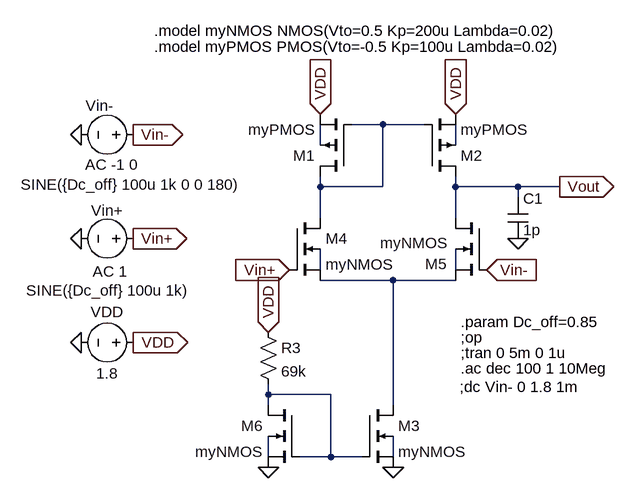
[diagram p0: schematic Cmos_Differential_Amplifier.asc]
Cmos_Differential_Amplifier.asc, the LTspice schematic file:
Version 4
SHEET 1 880 680
WIRE 160 -80 112 -80
WIRE 224 -80 160 -80
WIRE 64 -48 64 -80
WIRE 272 -48 272 -80
WIRE 64 16 64 0
WIRE 160 16 160 -80
WIRE 160 16 64 16
WIRE 272 16 272 0
WIRE 368 16 272 16
WIRE 432 16 368 16
WIRE 368 32 368 16
WIRE 64 64 64 16
WIRE 272 64 272 16
WIRE 64 144 64 112
WIRE 272 144 272 112
WIRE 176 160 64 160
WIRE 272 160 176 160
WIRE -16 336 -16 320
WIRE 80 336 -16 336
WIRE -16 352 -16 336
WIRE 176 352 176 160
WIRE -16 432 -16 400
WIRE 80 432 80 336
WIRE 80 432 32 432
WIRE 128 432 80 432
WIRE 176 432 176 400
FLAG -304 256 0
FLAG -224 256 VDD
IOPIN -224 256 Out
FLAG 64 -96 VDD
IOPIN 64 -96 In
FLAG 272 -96 VDD
IOPIN 272 -96 In
FLAG 432 16 Vout
IOPIN 432 16 Out
FLAG -304 96 0
FLAG -304 -64 0
FLAG -16 448 0
FLAG 176 448 0
FLAG -16 240 VDD
IOPIN -16 240 In
FLAG -224 96 Vin+
IOPIN -224 96 Out
FLAG -224 -64 Vin-
IOPIN -224 -64 Out
FLAG 320 144 Vin-
IOPIN 320 144 In
FLAG 16 144 Vin+
IOPIN 16 144 In
FLAG 368 96 0
SYMBOL voltage -208 96 R90
WINDOW 0 -59 56 VTop 2
WINDOW 3 64 55 VTop 2
WINDOW 123 35 52 VTop 2
WINDOW 39 0 0 Left 0
SYMATTR InstName Vin+
SYMATTR Value SINE({Dc_off} 100u 1k)
SYMATTR Value2 AC 1
SYMBOL voltage -208 256 R90
WINDOW 0 -32 56 VBottom 2
WINDOW 3 32 56 VTop 2
SYMATTR InstName VDD
SYMATTR Value 1.8
SYMBOL voltage -208 -64 M270
WINDOW 0 45 46 VRight 2
WINDOW 3 -77 -150 VRight 2
WINDOW 123 -46 8 VRight 2
WINDOW 39 0 0 Left 0
SYMATTR InstName Vin-
SYMATTR Value SINE({Dc_off} 100u 1k 0 0 180)
SYMATTR Value2 AC -1 0
SYMBOL pmos4 112 0 R180
SYMATTR InstName M1
SYMATTR Value myPMOS
SYMATTR Value2 l=1u w=4u
SYMBOL pmos4 224 0 M180
SYMATTR InstName M2
SYMATTR Value myPMOS
SYMATTR Value2 l=1u w=4u
SYMBOL nmos4 16 64 R0
SYMATTR InstName M4
SYMATTR Value myNMOS
SYMATTR Value2 l=1u w=4u
SYMBOL nmos4 320 64 M0
WINDOW 0 61 71 Left 2
WINDOW 3 60 39 Left 2
SYMATTR InstName M5
SYMATTR Value myNMOS
SYMATTR Value2 l=1u w=4u
SYMBOL nmos4 128 352 R0
SYMATTR InstName M3
SYMATTR Value myNMOS
SYMATTR Value2 l=1u w=4u
SYMBOL nmos4 32 352 M0
SYMATTR InstName M6
SYMATTR Value myNMOS
SYMATTR Value2 l=1u w=4u
SYMBOL res -32 224 R0
SYMATTR InstName R3
SYMATTR Value 69k
SYMBOL cap 352 32 R0
WINDOW 0 24 2 Left 2
WINDOW 3 24 51 Left 2
SYMATTR InstName C1
SYMATTR Value 1p
TEXT 280 272 Left 2 !;tran 0 5m 0 1u
TEXT 280 296 Left 2 !.ac dec 100 1 10Meg
TEXT 280 248 Left 2 !;op
TEXT -192 -224 Left 2 !.model myNMOS NMOS(Vto=0.5 Kp=200u Lambda=0.02)
TEXT -192 -200 Left 2 !.model myPMOS PMOS(Vto=-0.5 Kp=100u Lambda=0.02)
TEXT 278 324 Left 2 !;dc Vin- 0 1.8 1m
TEXT 280 224 Left 2 !.param Dc_off=0.85

The netlist it stands for:
* Cmos_Differential_Amplifier.asc
Vin+ Vin+ 0 SINE({Dc_off} 100u 1k) AC 1
VDD VDD 0 1.8
Vin- Vin- 0 SINE({Dc_off} 100u 1k 0 0 180) AC -1 0
M1 N001 N001 VDD N002 myPMOS l=1u w=4u
M2 Vout N001 VDD N003 myPMOS l=1u w=4u
M4 N001 Vin+ N006 N004 myNMOS l=1u w=4u
M5 Vout Vin- N006 N005 myNMOS l=1u w=4u
M3 N006 N007 0 N009 myNMOS l=1u w=4u
M6 N007 N007 0 N008 myNMOS l=1u w=4u
R3 VDD N007 69k
C1 Vout 0 1p
.model NMOS NMOS
.model PMOS PMOS
.lib standard.mos
;tran 0 5m 0 1u
.ac dec 100 1 10Meg
;op
.model myNMOS NMOS(Vto=0.5 Kp=200u Lambda=0.02)
.model myPMOS PMOS(Vto=-0.5 Kp=100u Lambda=0.02)
;dc Vin- 0 1.8 1m
.param Dc_off=0.85
.backanno
.end